# EAGLE design power_converter (EAGLE 9.2.1)
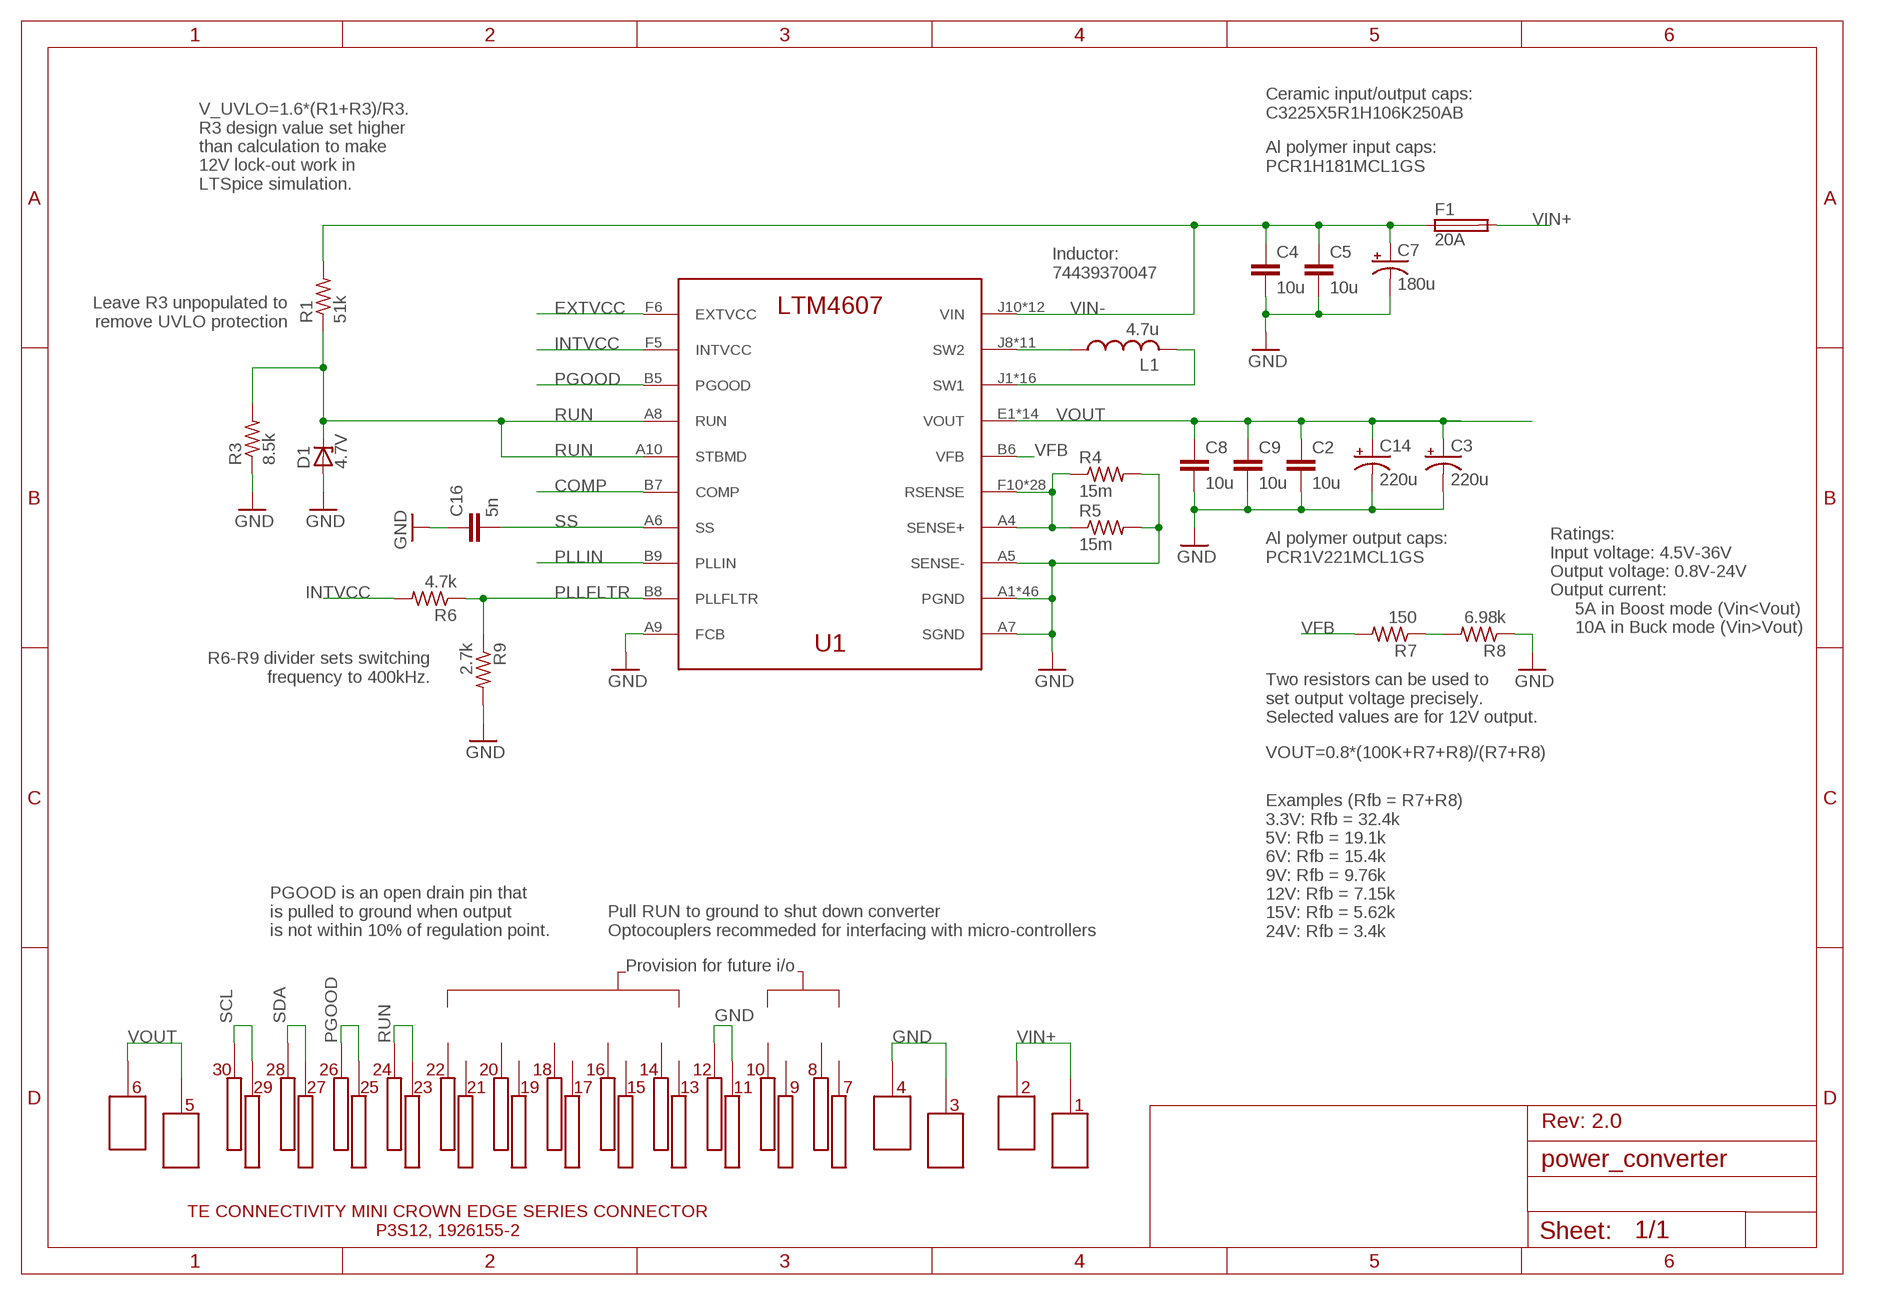
[diagram p0: schematic, sheet 1]

## Parts
C2  10u  C-EUC1210  [C1210]
C3  220u  PCR1V221MCL1GS  [PCR1V221MCL1GS]
C4  10u  C-EUC1210  [C1210]
C5  10u  C-EUC1210  [C1210]
C7  180u  PCR1H181MCL1GS  [PCR1H181MCL1GS]
C8  10u  C-EUC1210  [C1210]
C9  10u  C-EUC1210  [C1210]
C14  220u  PCR1V221MCL1GS  [PCR1V221MCL1GS]
C16  5n  C-EUC0603  [C0603]
D1  4.7V  ZENER-DIODESOD80C  [SOD80C]
F1  20A  501_FUSE  [R1206]
L1  4.7u  PA4343.472ANLT  [PA4343.472ANLT]
R1  51k  R-US_R0603  [R0603]
R3  8.5k  R-US_R0603  [R0603]
R4  15m  R-US_R1206  [R1206]
R5  15m  R-US_R1206  [R1206]
R6  4.7k  R-US_R0603  [R0603]
R7  150  R-US_R0603  [R0603]
R8  6.98k  R-US_R0603  [R0603]
R9  2.7k  R-US_R0603  [R0603]
U1  LTM4607EVPBF  [LGA-141]
U$1  1926155-2_CARD  [1926155-2_CARD]

## Nets
COMP: U1.B7(COMP)
EXTVCC: U1.F6(EXTVCC)
GND: C2.2 C3.NEG(-) C4.2 C5.2 C7.NEG(-) C8.2 C9.2 C14.NEG(-) C16.1 D1.A R3.1 R4.2 R5.2 R8.1 R9.2 U1.A1(PGND) U1.A2(PGND) U1.A3(PGND) U1.A5(SENSE-) U1.A7(SGND) U1.A9(FCB) U1.A11(PGND) U1.A12(PGND) U1.B1(PGND) U1.B2(PGND) U1.B3(PGND) U1.B4(PGND) U1.B10(PGND) U1.B11(PGND) U1.B12(PGND) U1.C1(PGND) U1.C2(PGND) U1.C3(PGND) U1.C4(PGND) U1.C5(PGND) U1.C6(PGND) U1.C7(PGND) U1.C8(PGND) U1.C9(PGND) U1.C10(PGND) U1.C11(PGND) U1.C12(PGND) U1.D1(PGND) U1.D2(PGND) U1.D3(PGND) U1.D4(PGND) U1.D5(PGND) U1.D6(PGND) U1.D7(PGND) U1.D8(PGND) U1.D9(PGND) U1.D10(PGND) U1.D11(PGND) U1.D12(PGND) U1.E3(PGND) U1.E4(PGND) U1.E5(PGND) U1.E6(PGND) U1.E7(PGND) U1.E8(PGND) U1.E9(PGND) U1.E10(PGND) U1.E11(PGND) U1.E12(PGND) U$1.P$3 U$1.P$4 U$1.P$11 U$1.P$12
INTVCC: R6.2 U1.F5(INTVCC)
N$1: R7.1 R8.2
PGOOD: U1.B5(PGOOD) U$1.P$25 U$1.P$26
PLLFLTR: R6.1 R9.1 U1.B8(PLLFLTR)
PLLIN: U1.B9(PLLIN)
RSENSE: R4.1 R5.1 U1.A4(SENSE+) U1.F10(RSENSE) U1.F11(RSENSE) U1.F12(RSENSE) U1.G5(RSENSE) U1.G6(RSENSE) U1.G7(RSENSE) U1.G8(RSENSE) U1.G9(RSENSE) U1.G10(RSENSE) U1.G11(RSENSE) U1.G12(RSENSE) U1.H5(RSENSE) U1.H6(RSENSE) U1.H7(RSENSE) U1.H8(RSENSE) U1.H9(RSENSE) U1.H10(RSENSE) U1.H11(RSENSE) U1.H12(RSENSE) U1.J5(RSENSE) U1.J6(RSENSE) U1.J7(RSENSE) U1.K5(RSENSE) U1.K6(RSENSE) U1.L5(RSENSE) U1.L6(RSENSE) U1.M5(RSENSE) U1.M6(RSENSE)
RUN: D1.C R1.1 R3.2 U1.A8(RUN) U1.A10(STBMD) U$1.P$23 U$1.P$24
SCL: U$1.P$29 U$1.P$30
SDA: U$1.P$27 U$1.P$28
SS: C16.2 U1.A6(SS)
SW1: L1.P$2 U1.J1(SW1) U1.J2(SW1) U1.J3(SW1) U1.J4(SW1) U1.K1(SW1) U1.K2(SW1) U1.K3(SW1) U1.K4(SW1) U1.L1(SW1) U1.L2(SW1) U1.L3(SW1) U1.L4(SW1) U1.M1(SW1) U1.M2(SW1) U1.M3(SW1) U1.M4(SW1)
SW2: L1.P$1 U1.J8(SW2) U1.J9(SW2) U1.K7(SW2) U1.K8(SW2) U1.K9(SW2) U1.L7(SW2) U1.L8(SW2) U1.L9(SW2) U1.M7(SW2) U1.M8(SW2) U1.M9(SW2)
VFB: R7.2 U1.B6(VFB)
VIN+: F1.2 U$1.P$1 U$1.P$2
VIN-: C4.1 C5.1 C7.POS(+) F1.1 R1.2 U1.J10(VIN) U1.J11(VIN) U1.J12(VIN) U1.K10(VIN) U1.K11(VIN) U1.K12(VIN) U1.L10(VIN) U1.L11(VIN) U1.L12(VIN) U1.M10(VIN) U1.M11(VIN) U1.M12(VIN)
VOUT: C2.1 C3.POS(+) C8.1 C9.1 C14.POS(+) U1.E1(VOUT) U1.E2(VOUT) U1.F1(VOUT) U1.F2(VOUT) U1.F3(VOUT) U1.F4(VOUT) U1.G1(VOUT) U1.G2(VOUT) U1.G3(VOUT) U1.G4(VOUT) U1.H1(VOUT) U1.H2(VOUT) U1.H3(VOUT) U1.H4(VOUT) U$1.P$5 U$1.P$6
Unconnected: U$1.P$7 U$1.P$8 U$1.P$9 U$1.P$10 U$1.P$13 U$1.P$14 U$1.P$15 U$1.P$16 U$1.P$17 U$1.P$18 U$1.P$19 U$1.P$20 U$1.P$21 U$1.P$22

## Notes on the sheet
- Ceramic input/output caps:
  C3225X5R1H106K250AB
- Al polymer input caps:
  PCR1H181MCL1GS
- V_UVLO=1.6*(R1+R3)/R3.
  R3 design value set higher 
  than calculation to make
  12V lock-out work in
  LTSpice simulation.
- Inductor:
  74439370047
- Leave R3 unpopulated to
  remove UVLO protection
- Ratings:
  Input voltage: 4.5V-36V
  Output voltage: 0.8V-24V
  Output current:
       5A in Boost mode (Vin<Vout)
       10A in Buck mode (Vin>Vout)
- Al polymer output caps:
  PCR1V221MCL1GS
- R6-R9 divider sets switching
  frequency to 400kHz.
- Two resistors can be used to
  set output voltage precisely.
  Selected values are for 12V output.
- VOUT=0.8*(100K+R7+R8)/(R7+R8)
- Examples (Rfb = R7+R8)
  3.3V: Rfb = 32.4k
  5V: Rfb = 19.1k
  6V: Rfb = 15.4k
  9V: Rfb = 9.76k
  12V: Rfb = 7.15k
  15V: Rfb = 5.62k
  24V: Rfb = 3.4k
- PGOOD is an open drain pin that
  is pulled to ground when output
  is not within 10% of regulation point.
- Pull RUN to ground to shut down converter
  Optocouplers recommeded for interfacing with micro-controllers
- Provision for future i/o
- Rev: 2.0

## Library data of the parts
C2 C4 C5 C8 C9 C16 = rcl:C-EU: CAPACITOR, European symbol; SPICEPREFIX: C
C3 C14 = LTM4607:PCR1V221MCL1GS
C7 = LTM4607:PCR1H181MCL1GS
D1 = diode:ZENER-DIODE: Z-Diode
F1 = LTM4607:501_FUSE
L1 = LTM4607:PA4343.472ANLT
R1 R3-R9 = rcl:R-US_: RESISTOR, American symbol; SPICEPREFIX: R
U1 = LTM4607:LTM4607EVPBF; MANUFACTURER_PART_NUMBER: LTM4607EV#PBF; VENDOR: Linear Technology
U$1 = LTM4607:1926155-2_CARD

## Board
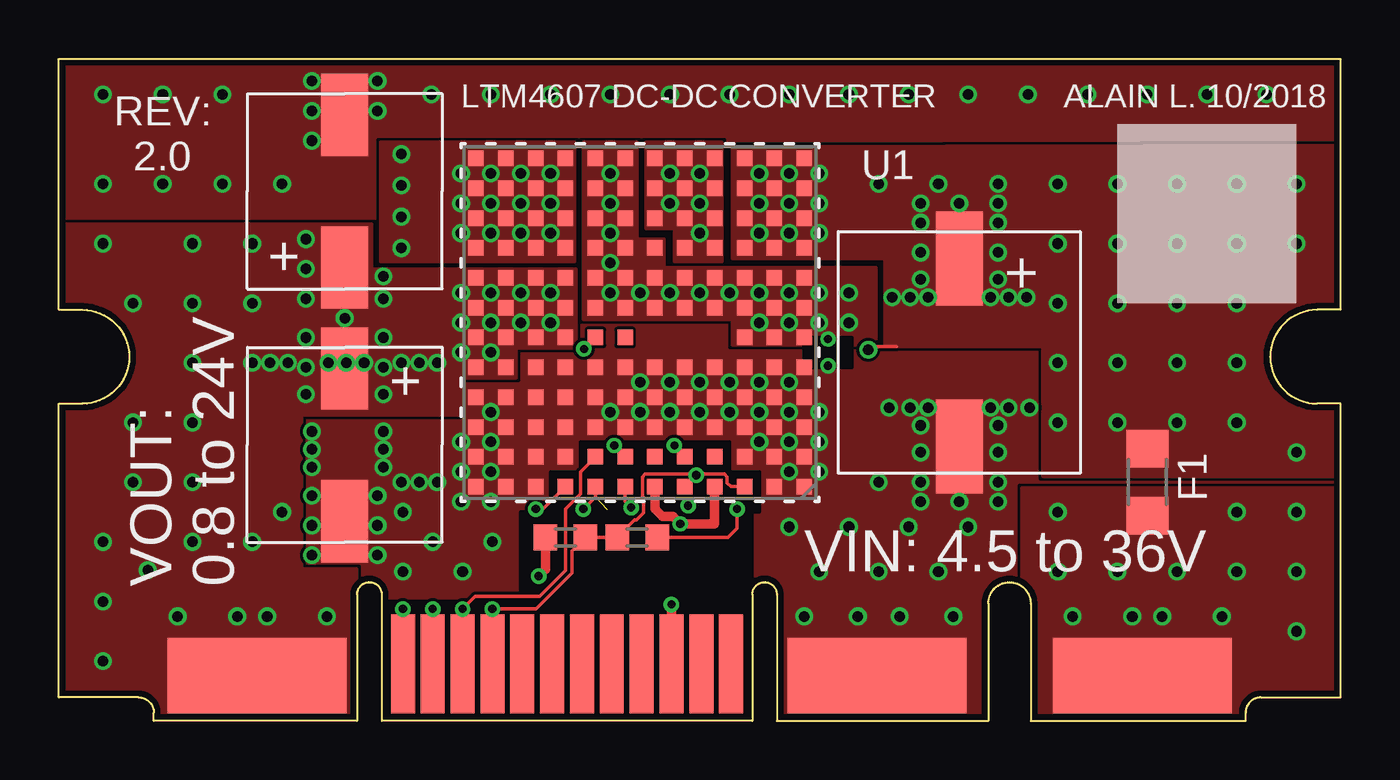
[diagram p1: board, top side]
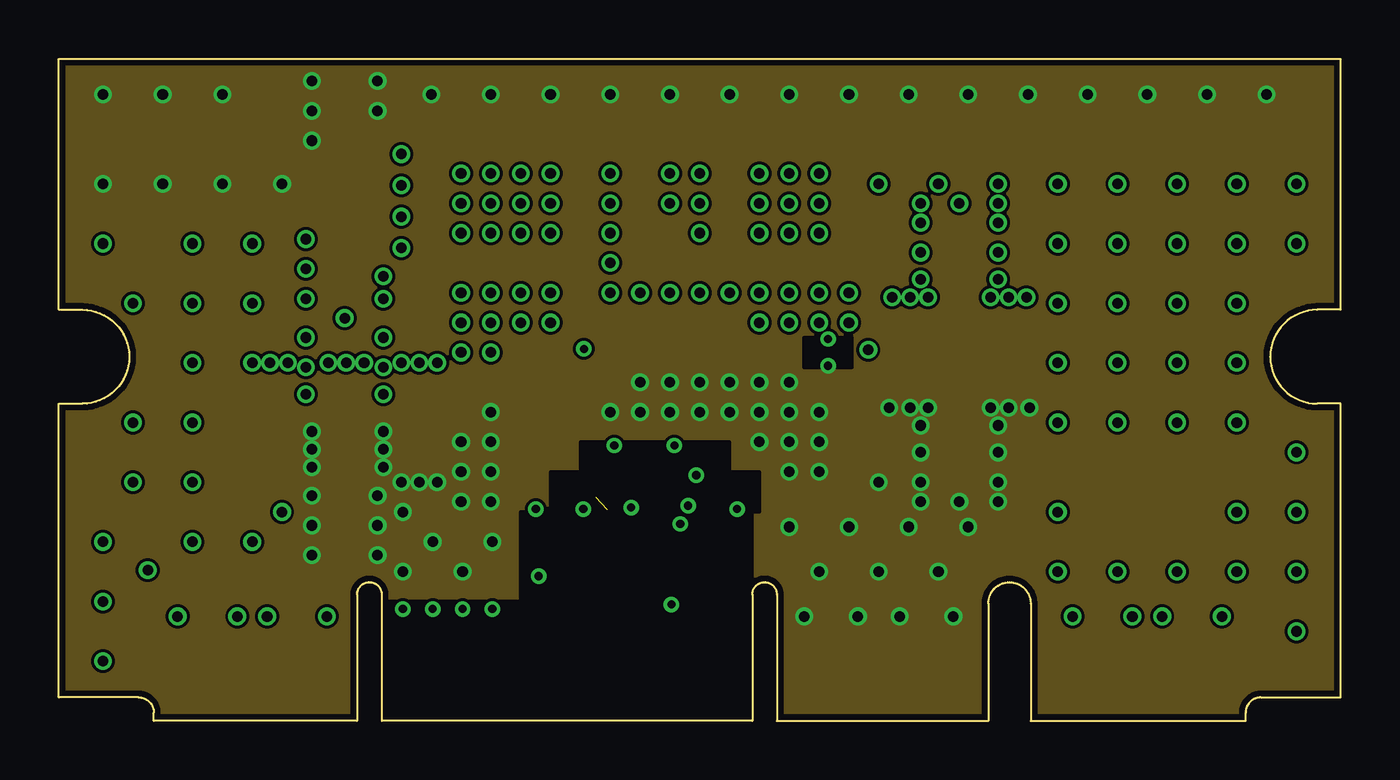
[diagram p2: board, inner layer Route2]
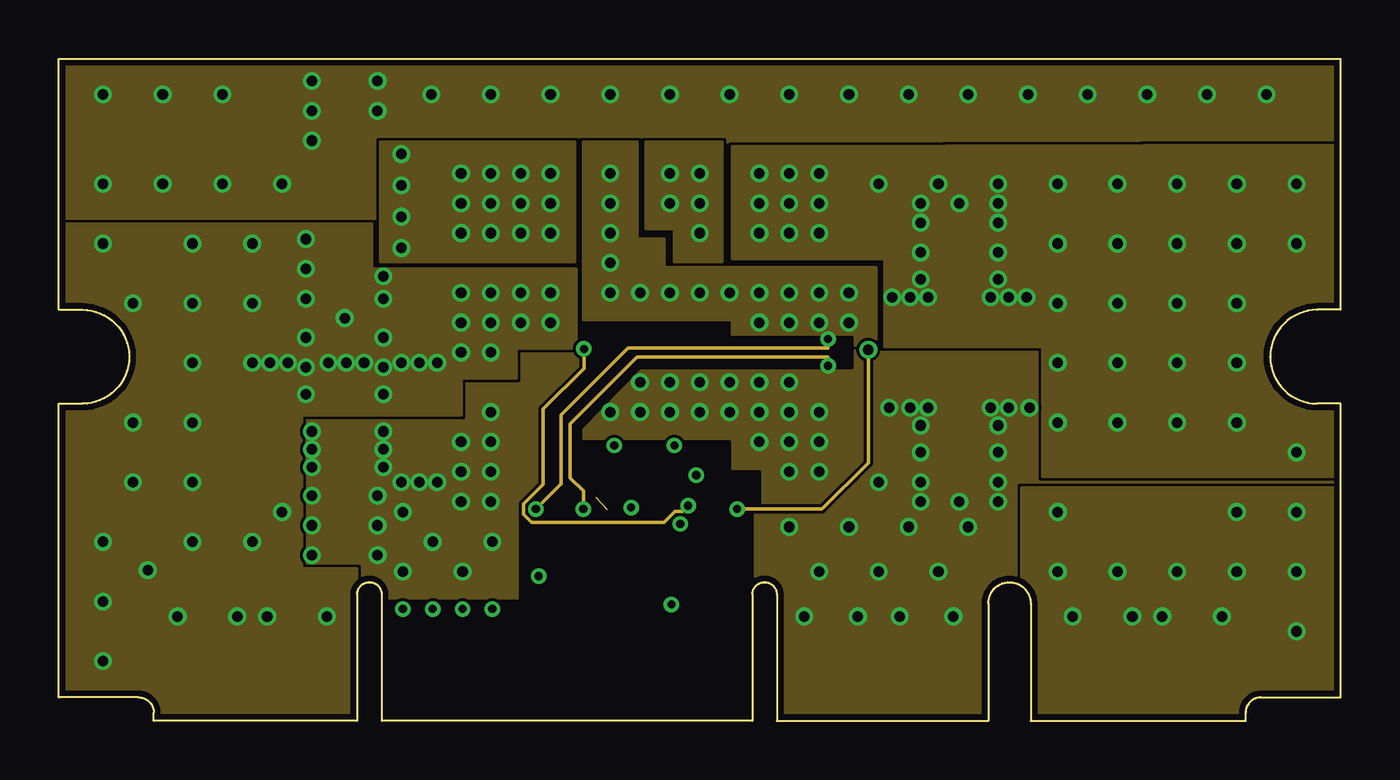
[diagram p3: board, inner layer Route15]
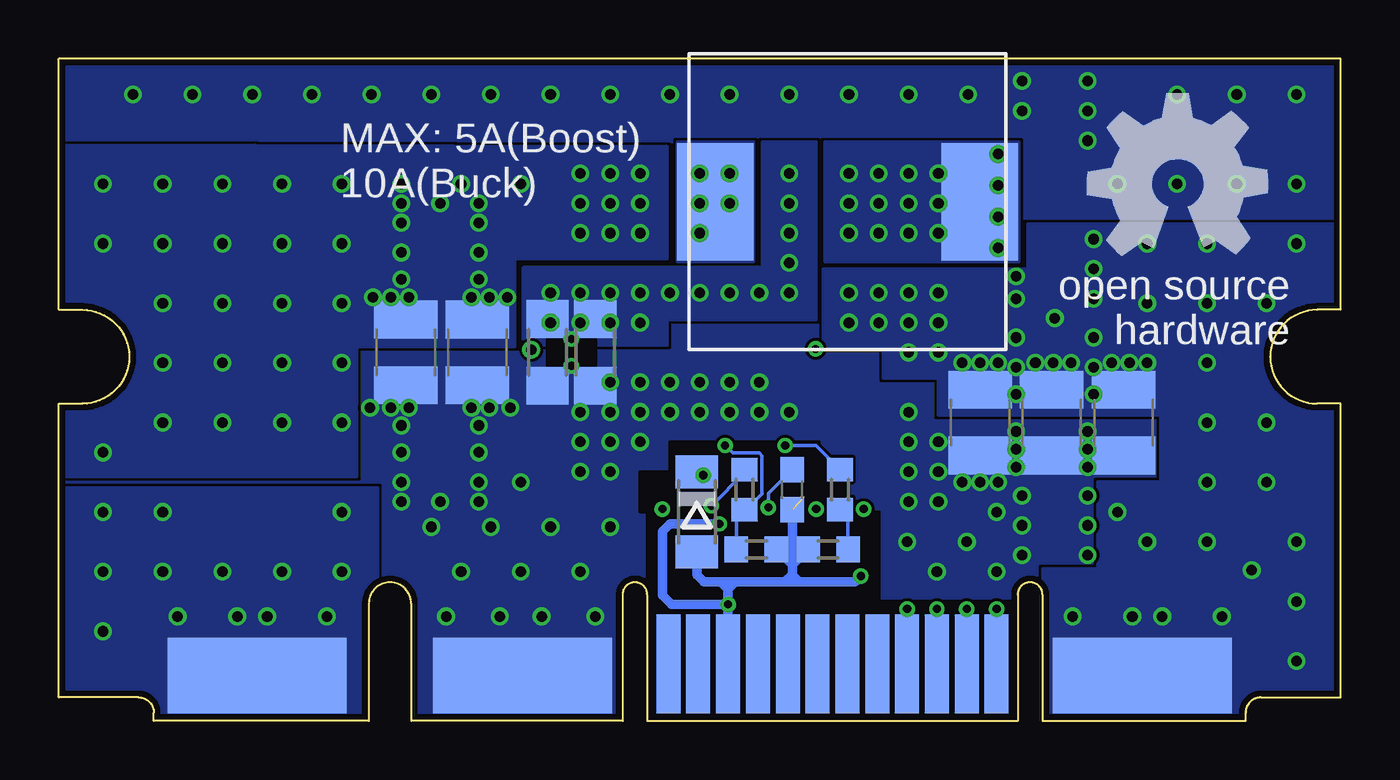
[diagram p4: board, bottom side, seen from below]

Size 54.57 x 28.19 mm. Coordinates in mm from the lower left corner, seen from the top.
Copper layers (1*2*15*16): Top 0.035mm / dielectric 0.1702mm / Route2 0.0175mm / dielectric 47mil / Route15 0.0175mm / dielectric 0.1702mm / Bottom 0.035mm
Design rules "JLCPCB4Layer *": minimum track width 3.5mil, minimum drill 0.2mm, track to track 5mil, track to pad 5mil, pad to pad 5mil, via to via 5mil, smd to smd 0mil, copper to edge 10mil, drill to drill 10mil, minimum pad ring 6mil, minimum via ring 6mil, stop-mask expansion 2mil, vias tented up to drill 100mil, thermal gap 10mil

### Footprints (pad centres in the part's own frame; a part is rotated, then mirrored left to right if it is on the bottom)
C1210 = smd 1.6 x 2.7: 1 -1.4,0; 2 1.4,0
PCR1V221MCL1GS = smd 2 x 3.5: NEG 0,-3.25; POS 0,3.25
PCR1H181MCL1GS = smd 2 x 4: NEG 0,-4; POS 0,4
C0603 = smd 1.1 x 1: 1 -0.85,0; 2 0.85,0
SOD80C = smd 1.4 x 1.8: A 1.7,0; C -1.7,0
R1206 = smd 1.6 x 1.803: 1 -1.422,0; 2 1.422,0
PA4343.472ANLT = smd 3.25 x 5: P$1 -5.625,0; P$2 5.625,0
R0603 = smd 1 x 1.1: 1 -0.85,0; 2 0.85,0
LGA-141 = smd 0.66 x 0.66: A1 6.985,6.985; A2 5.715,6.985; A3 4.445,6.985; A4 3.175,6.985; A5 1.905,6.985; A6 0.635,6.985; A7 -0.635,6.985; A8 -1.905,6.985; A9 -3.175,6.985; A10 -4.445,6.985; A11 -5.715,6.985; A12 -6.985,6.985; B1 6.985,5.715; B2 5.715,5.715; B3 4.445,5.715; B4 3.175,5.715; B5 1.905,5.715; B6 0.635,5.715; B7 -0.635,5.715; B8 -1.905,5.715; B9 -3.175,5.715; B10 -4.445,5.715; B11 -5.715,5.715; B12 -6.985,5.715; C1 6.985,4.445; C2 5.715,4.445; C3 4.445,4.445; C4 3.175,4.445; C5 1.905,4.445; C6 0.635,4.445; C7 -0.635,4.445; C8 -1.905,4.445; C9 -3.175,4.445; C10 -4.445,4.445; C11 -5.715,4.445; C12 -6.985,4.445; D1 6.985,3.175; D2 5.715,3.175; D3 4.445,3.175; D4 3.175,3.175; D5 1.905,3.175; D6 0.635,3.175; D7 -0.635,3.175; D8 -1.905,3.175; D9 -3.175,3.175; D10 -4.445,3.175; D11 -5.715,3.175; D12 -6.985,3.175; E1 6.985,1.905; E2 5.715,1.905; E3 4.445,1.905; E4 3.175,1.905; E5 1.905,1.905; E6 0.635,1.905; E7 -0.635,1.905; E8 -1.905,1.905; E9 -3.175,1.905; E10 -4.445,1.905; E11 -5.715,1.905; E12 -6.985,1.905; F1 6.985,0.635; F2 5.715,0.635; F3 4.445,0.635; F4 3.175,0.635; F5 1.905,0.635; F6 0.635,0.635; F10 -4.445,0.635; F11 -5.715,0.635; F12 -6.985,0.635; G1 6.985,-0.635; G2 5.715,-0.635; G3 4.445,-0.635; G4 3.175,-0.635; G5 1.905,-0.635; G6 0.635,-0.635; G7 -0.635,-0.635; G8 -1.905,-0.635; G9 -3.175,-0.635; G10 -4.445,-0.635; G11 -5.715,-0.635; G12 -6.985,-0.635; H1 6.985,-1.905; H2 5.715,-1.905; H3 4.445,-1.905; H4 3.175,-1.905; H5 1.905,-1.905; H6 0.635,-1.905; H7 -0.635,-1.905; H8 -1.905,-1.905; H9 -3.175,-1.905; H10 -4.445,-1.905; H11 -5.715,-1.905; H12 -6.985,-1.905; J1 6.985,-3.175; J2 5.715,-3.175; J3 4.445,-3.175; J4 3.175,-3.175; J5 1.905,-3.175; J6 0.635,-3.175; J7 -0.635,-3.175; J8 -1.905,-3.175; J9 -3.175,-3.175; J10 -4.445,-3.175; J11 -5.715,-3.175; J12 -6.985,-3.175; K1 6.985,-4.445; K2 5.715,-4.445; K3 4.445,-4.445; K4 3.175,-4.445; K5 1.905,-4.445; K6 0.635,-4.445; K7 -0.635,-4.445; K8 -1.905,-4.445; K9 -3.175,-4.445; K10 -4.445,-4.445; K11 -5.715,-4.445; K12 -6.985,-4.445; L1 6.985,-5.715; L2 5.715,-5.715; L3 4.445,-5.715; L4 3.175,-5.715; L5 1.905,-5.715; L6 0.635,-5.715; L7 -0.635,-5.715; L8 -1.905,-5.715; L9 -3.175,-5.715; L10 -4.445,-5.715; L11 -5.715,-5.715; L12 -6.985,-5.715; M1 6.985,-6.985; M2 5.715,-6.985; M3 4.445,-6.985; M4 3.175,-6.985; M5 1.905,-6.985; M6 0.635,-6.985; M7 -0.635,-6.985; M8 -1.905,-6.985; M9 -3.175,-6.985; M10 -4.445,-6.985; M11 -5.715,-6.985; M12 -6.985,-6.985
1926155-2_CARD = smd 7.62 x 3.2: P$1 18.835,1.929; P$3 7.535,1.929; P$5 -18.835,1.929 | smd 7.62 x 3.2 bottom: P$2 18.835,1.929; P$4 7.535,1.929; P$6 -18.835,1.929 | smd 1.02 x 4.2: P$7 1.335,2.429; P$9 0.065,2.429; P$11 -1.205,2.429; P$13 -2.475,2.429; P$15 -3.745,2.429; P$17 -5.015,2.429; P$19 -6.285,2.429; P$21 -7.555,2.429; P$23 -8.825,2.429; P$25 -10.095,2.429; P$27 -11.365,2.429; P$29 -12.635,2.429 | smd 1.02 x 4.2 bottom: P$8 1.335,2.429; P$10 0.065,2.429; P$12 -1.205,2.429; P$14 -2.475,2.429; P$16 -3.745,2.429; P$18 -5.015,2.429; P$20 -6.285,2.429; P$22 -7.555,2.429; P$24 -8.825,2.429; P$26 -10.095,2.429; P$28 -11.365,2.429; P$30 -12.635,2.429

### Placement (x,y rotation side)
C2  9.25,12.7 270 bottom
C3  12.17,11.75 0 top
C4  36.75,15.68 270 bottom
C5  39.79,15.68 270 bottom
C7  38.33,15.68 0 top
C8  12.3,12.7 270 bottom
C9  15.35,12.7 270 bottom
C14  12.17,22.54 180 top
C16  23.35,9.84 90 bottom
D1  27.41,8.89 270 bottom
F1  46.34,10.16 270 top
L1  21,22.1 0 bottom
R1  24.62,7.81 0 top
R3  21.57,7.81 0 top
R4  31.73,15.68 270 bottom
R5  33.76,15.68 270 bottom
R6  25.38,9.84 90 bottom
R7  21.32,9.84 90 bottom
R8  21.82,7.3 0 bottom
R9  24.87,7.3 0 bottom
U1  24.75,16.95 180 top
U$1  27.29,0 0 top
U$2  [OSHW_8MM]  6.97,22.86 0 bottom
U$5  [A4L-LOC]  -102.25,-77.47 0 top  (outside the outline)

### Tracks (layer width: path | path; a pad name or v marks a point on that pad's centre or on a via)
GND  (via drill 0.35, 0.45)  (1 unrouted)
  Top 0.152: v22.33,9.02 22.84,9.52 U1.A5
  Top 0.406: v26.08,4.95 U$1.P$11 | U1.A7 25.38,9.02 25.7,8.7 26.14,8.7 v26.46,8.38 27.92,8.38 U1.A9 | v20.43,6.16 20.72,6.45 R3.1
  Route15 0.152: v32.75,15.11 32.75,15.49 24.62,15.49 21.76,12.64 21.76,10.35 22.33,9.78 v22.33,9.02
  Bottom 0.406: 26.08,5.59 26.4,5.91 | 26.4,5.91 27.09,5.91 27.41,6.22 D1.A | U$1.P$11 v26.08,4.95 | 26.08,5.59 25.76,5.91 | 25.76,5.91 23.92,5.91 | 23.92,5.91 23.67,5.91 23.35,6.22 | 23.35,6.63 R9.2 | 23.35,6.22 23.35,6.63 | 23.35,6.63 R8.1 | 25.76,5.91 26.4,5.91 | 26.08,5.59 v26.08,4.95 | v26.08,4.95 28.49,4.95 28.87,5.33 28.87,8.06 28.56,8.38 v26.46,8.38 | 23.35,6.22 23.03,5.91 | v20.43,6.16 20.68,5.91 23.03,5.91 | 23.03,5.91 23.92,5.91 | 23.35,6.22 C16.1 | R5.2 33.6,14.26 v32.75,15.11 31.9,14.26 R4.2
  other vias: 18.4,10.6 18.4,11.87 18.4,13.14 18.4,9.33 17.12,9.33 17.12,10.6 17.12,11.87 24.75,14.41 24.75,13.14 23.48,13.14 26.02,13.14 26.02,14.41 27.29,14.41 27.29,13.14 28.56,13.14 28.56,14.41 29.83,14.41 29.83,13.14 29.83,11.87 31.1,13.14 31.1,14.41 32.37,11.87 32.37,13.14 31.1,11.87 31.1,10.6 32.37,10.6 31.1,8.25 32.37,6.35 33.64,8.25 36.17,8.25 38.72,8.25 34.91,6.35 37.45,6.35 34.02,4.44 35.79,4.44 38.08,4.44 31.73,4.44 34.91,10.16 36.68,12.57 39.98,12.57 36.68,9.33 39.98,9.33 39.98,11.43 36.68,11.43 36.68,10.16 39.98,10.16 38.33,9.33 36.24,13.33 37,13.33 35.35,13.33 39.67,13.33 40.43,13.33 41.32,13.33 10.78,11.56 10.78,10.79 15.35,10.16 14.59,10.16 16.11,10.16 13.82,11.56 13.82,12.32 13.82,10.79 10.78,12.32 10.78,7.05 10.78,8.32 10.78,9.59 13.57,7.05 13.57,8.32 13.57,9.59 10.78,24.7 10.78,25.97 10.78,27.24 13.57,25.97 13.57,27.24 17.19,6.35 14.65,6.35 14.65,8.89 18.46,7.62 15.92,7.62 1.89,26.67 1.89,22.86 4.43,22.86 4.43,26.67 6.97,26.67 6.97,22.86 9.51,22.86 15.86,26.67 18.4,26.67 20.94,26.67 23.48,26.67 26.02,26.67 28.56,26.67 31.1,26.67 33.64,26.67 36.17,26.67 38.72,26.67 41.25,26.67 43.8,26.67 46.34,26.67 48.88,26.67 51.42,26.67
  pour Top (rank 6, no thermals): -0.65,0 -0.65,29.21 55.23,29.21 55.23,0
  pour Route2 (rank 6, no thermals): -0.65,29.21 55.23,29.21 55.23,0 -0.65,0
  pour Bottom (rank 6, no thermals): -0.65,29.21 55.23,29.21 55.23,0 -0.65,0
  pour Route15 (rank 6, no thermals): -0.65,29.21 55.23,29.21 55.23,0 -0.65,0
  cutout Top: 13.76,0 13.76,5.08 19.67,5.08 19.67,8.89 20.94,8.89 20.94,10.6 22.21,10.6 22.21,11.87 22.27,11.87 28.56,11.87 28.56,10.6 28.68,10.6 29.83,10.6 29.83,10.16 29.83,8.89 29.51,8.89 29.51,0
  cutout Route15 (no thermals): 33.76,16.32 24.11,16.32 20.94,13.14 20.94,10.6 20.94,9.33 23.35,9.33 23.35,10.6 22.21,10.6 22.21,12.45 24.75,15.05 33.76,15.05
  cutout Top (no thermals): 33.76,16.32 31.73,16.32 31.73,15.05 33.76,15.05
  cutout Route2 (no thermals): 33.76,16.32 31.73,16.32 31.73,15.05 33.76,15.05
  cutout Route2 (no thermals): 23.35,10.6 20.94,10.6 20.94,9.33 23.35,9.33
  cutout Top (no thermals): 23.35,10.6 20.94,10.6 20.94,9.33 23.35,9.33
  cutout Route15: 13.76,0 13.76,5.08 19.67,5.08 19.67,8.89 20.94,8.89 20.94,10.6 22.21,10.6 22.21,11.87 22.27,11.87 28.56,11.87 28.56,10.6 28.68,10.6 29.83,10.6 29.83,10.16 29.83,8.89 29.51,8.89 29.51,0
  cutout Route2: 13.76,0 13.76,5.08 19.67,5.08 19.67,8.89 20.94,8.89 20.94,10.6 22.21,10.6 22.21,11.87 22.27,11.87 28.56,11.87 28.56,10.6 28.68,10.6 29.83,10.6 29.83,10.16 29.83,8.89 29.51,8.89 29.51,0
  cutout Bottom: 13.76,0 13.76,5.08 19.67,5.08 19.67,8.89 20.94,8.89 20.94,10.6 22.21,10.6 22.21,11.87 22.27,11.87 28.56,11.87 28.56,10.6 28.68,10.6 29.83,10.6 29.83,10.16 29.83,8.89 29.51,8.89 29.51,0
  cutout Bottom (no thermals): 33.76,16.32 31.73,16.32 31.73,15.05 33.76,15.05
INTVCC  (via drill 0.35)
  Top 0.152: U1.F5 v22.36,15.83
  Route15 0.152: v22.36,15.83 22.36,15.01 20.62,13.27 20.62,10.07 19.78,9.24 19.78,8.8 20.13,8.45 25.77,8.45 26.24,8.91 26.55,8.91 v26.79,9.16
  Bottom 0.152: v26.79,9.16 25.38,10.57 R6.2
N$1
  Bottom 0.152: R8.2 20.97,8.65 R7.1
PGOOD  (via drill 0.35)
  Top 0.152: U1.B5 22.21,10.6 22.21,9.65 21.57,9.02 21.57,6.41 20.46,5.3 17.73,5.3 v17.19,4.76 U$1.P$25
  Bottom 0.152: v17.19,4.76 U$1.P$25
PLLFLTR  (via drill 0.35)
  Top 0.152: U1.B8 26.21,11.68 v26.21,11.72
  Bottom 0.152: R9.1 25.72,8.65 R6.1 25.3,8.99 24.64,9.65 24.64,9.79 24.63,9.81 24.63,11.28 24.75,11.4 25.88,11.4 v26.21,11.72
RSENSE  (via drill 0.35, 0.45)
  Top 0.152: v20.31,9.02 20.62,9.02 U1.A4
  Route15 0.152: v32.75,16.26 32.75,15.87 24.24,15.87 21.38,13.02 21.38,10.08 v20.31,9.02
  Bottom 0.406: R5.1 33.6,17.11 v32.75,16.26 31.9,17.11 R4.1
  other vias: 23.48,23.3 23.48,22.03 23.48,20.76 23.48,19.49 23.48,18.22 24.75,18.22 26.02,18.22 27.29,18.22 28.56,18.22 29.83,18.22 29.83,16.95 31.1,16.95 31.1,18.22 32.37,18.22 32.37,16.95 33.64,18.22 33.64,16.95
  pour Top (no thermals): 22.33,24.64 24.62,24.64 24.62,20.51 25.76,20.51 25.76,19.3 34.78,19.3 34.78,16 32.3,16 28.68,16 28.68,17.02 28.68,17.08 22.33,17.08
  pour Route15 (no thermals): 22.33,24.64 24.62,24.64 24.62,20.51 25.76,20.51 25.76,19.3 34.78,19.3 34.78,16 33.57,16 28.68,16 28.68,17.02 28.68,17.08 22.33,17.08
  pour Bottom (no thermals): 22.33,24.64 24.62,24.64 24.62,19.3 34.78,19.3 34.78,16 32.3,16 28.68,16 28.68,17.02 28.68,17.08 22.33,17.08
RUN  (via drill 0.35)
  Top 0.152: 26.97,10.5 24.97,10.5 24.85,10.38 24.85,9.55 24.9,9.51 24.9,8.86 24.58,8.55 24.51,8.55 R1.1 R3.2 21.85,7.24 21.85,6.3 20.31,4.76 v18.46,4.76 U$1.P$24 | 26.97,10.5 27.29,10.5 | 27.29,10.5 28.33,10.5 28.45,10.38 28.45,10.13 28.62,9.97 U1.A10 | 27.29,10.5 27.24,10.45 v27.14,10.45 | U1.A8 26.97,10.29 26.97,10.5
  Bottom 0.152: v27.14,10.45 27.28,10.45 D1.C | v18.46,4.76 U$1.P$24
SCL  (via drill 0.35)
  Top 0.152: U$1.P$29 v14.65,4.76
  Bottom 0.152: v14.65,4.76 U$1.P$29
SDA  (via drill 0.35)
  Top 0.152: U$1.P$28 v15.92,4.76
  Bottom 0.152: v15.92,4.76 U$1.P$28
SS  (via drill 0.35)
  Top 0.152: v24.36,9.08 24.11,9.33 U1.A6
  Bottom 0.152: C16.2 24.36,9.68 v24.36,9.08
SW1  (via drill 0.45)
  other vias: 20.94,20.76 20.94,22.03 20.94,23.3 19.67,23.3 19.67,22.03 19.67,20.76 18.4,20.76 18.4,23.3 18.4,22.03 17.12,22.03 17.12,23.3 17.12,20.76 14.59,24.13 14.59,22.8 14.59,21.46 14.59,20.13
  pour Top (no thermals): 13.7,19.56 13.7,24.64 21.95,24.64 21.95,19.56
  pour Route15 (no thermals): 13.7,19.56 13.7,24.64 21.95,24.64 21.95,19.56
  pour Bottom (no thermals): 13.7,19.56 13.7,24.64 21.95,24.64 21.95,19.56
SW2  (via drill 0.45)
  other vias: 26.02,23.3 26.02,22.03 27.29,22.03 27.29,23.3 27.29,20.76
  pour Bottom (no thermals): 28.24,24.64 25,24.64 25,24.57
  pour Route15 (no thermals): 28.24,24.64 25,24.64 25,24.57
  pour Top (rank 2, no thermals): 28.24,24.64 25,24.64 25,24.57 25,20.96 26.21,20.96 26.21,19.56 28.24,19.56
  pour Route15 (rank 2, no thermals): 28.24,24.64 25,24.64 25,24.57 25,20.96 26.21,20.96 26.21,19.56 28.24,19.56
  pour Bottom (rank 2, no thermals): 28.24,24.64 25,24.64 25,24.57 25,19.56 28.24,19.56
VFB  (via drill 0.35)
  Top 0.152: U1.B6 v23.64,11.72
  Bottom 0.152: v23.64,11.72 22.35,11.72 R7.2
VIN+  (via drill 0.45)
  other vias: 42.53,8.89 42.53,6.35 45.06,6.35 47.61,6.35 50.14,6.35 52.69,6.35 52.69,8.89 50.14,8.89 49.51,4.44 46.97,4.44 45.7,4.44 43.16,4.44 52.69,3.81
  pour Top (no thermals): 41.25,9.91 54.59,9.91 54.59,-0.06 41,-0.06 41,9.91
  pour Route15 (no thermals): 41.25,9.91 54.59,9.91 54.59,-0.06 41,-0.06 41,9.91
  pour Bottom (no thermals): 41.25,9.91 54.59,9.91 54.59,-0.06 41,-0.06 41,9.91
VIN-  (via drill 0.35, 0.45)
  Top 0.152: R1.2 28.49,7.81 28.87,8.19 v28.87,9.02 | v34.46,15.8 34.6,15.94 35.67,15.94
  Route15 0.152: v28.87,9.02 32.49,9.02 34.46,10.98 v34.46,15.8
  other vias: 29.83,23.3 31.1,23.3 31.1,22.03 29.83,22.03 29.83,20.76 31.1,20.76 32.37,20.76 32.37,22.03 32.37,23.3 39.98,18.8 36.68,18.8 39.98,22.03 36.68,22.03 36.68,19.94 39.98,19.94 39.98,21.21 36.68,21.21 38.33,22.03 36.24,18.03 35.48,18.03 37,18.03 39.67,18.03 40.43,18.03 41.19,18.03 34.91,22.86 37.45,22.86 39.98,22.86 42.53,22.86 45.06,22.86 47.61,22.86 50.14,22.86 52.69,22.86 52.69,20.32 50.14,20.32 47.61,20.32 45.06,20.32 42.53,20.32 42.53,17.78 45.06,17.78 47.61,17.78 50.14,17.78 50.14,15.24 47.61,15.24 45.06,15.24 42.53,15.24 42.53,12.7 45.06,12.7 47.61,12.7 50.14,12.7 52.69,11.43
  pour Top (rank 2, no thermals): 28.75,19.68 28.68,19.68 28.68,24.45 29.32,24.45 54.59,24.51 54.59,11.56 54.59,10.41 41.89,10.41 41.89,15.94 35.16,15.94 35.16,19.68
  pour Route15 (rank 2, no thermals): 28.75,19.68 28.68,19.68 28.68,24.45 29.32,24.45 54.59,24.51 54.59,11.56 54.59,10.41 41.89,10.41 41.89,15.94 35.16,15.94 35.16,19.68
  pour Bottom (rank 2, no thermals): 28.75,19.68 28.68,19.68 28.68,24.45 29.32,24.45 54.59,24.51 54.59,11.56 54.59,10.41 41.89,10.41 41.89,15.94 35.16,15.94 35.16,19.68
VOUT  (via drill 0.45)
  other vias: 18.4,16.95 18.4,18.22 19.67,18.22 20.94,18.22 20.94,16.95 19.67,16.95 17.12,16.95 17.12,18.22 18.4,15.68 17.12,15.68 13.82,13.91 10.52,13.91 10.52,15.05 13.82,15.05 13.82,16.32 10.52,16.32 12.17,17.14 9,15.24 8.24,15.24 9.76,15.24 14.59,15.24 15.35,15.24 16.11,15.24 12.24,15.24 11.47,15.24 13,15.24 10.52,17.97 10.52,19.24 10.52,20.51 13.82,17.97 13.82,18.92 1.89,20.32 3.16,17.78 5.7,20.32 8.24,17.78 5.7,15.24 5.7,17.78 3.16,12.7 5.7,10.16 5.7,12.7 8.24,7.62 5.7,7.62 5.06,4.44 7.6,4.44 8.87,4.44 1.89,5.08 1.89,7.62 3.16,10.16 1.89,2.54 9.51,8.89 8.24,20.32 11.41,4.44 3.79,6.41
  pour Top (no thermals): 22.01,19.24 13.32,19.24 13.32,19.49 13.32,21.15 11.09,21.15 11.03,21.15 0.04,21.15 0.04,0 12.05,0 12.43,0 12.68,0 12.68,6.48 10.33,6.48 10.33,13.02 12.68,13.02 13.32,13.02 17.12,13.02 17.12,14.48 17.12,14.6 18.14,14.6 19.47,14.6 19.47,15.43 19.47,15.87 22.01,15.87
  pour Bottom (no thermals): 22.01,19.24 13.32,19.24 13.32,19.49 13.32,21.15 11.09,21.15 11.03,21.15 0.04,21.15 0.04,0 12.05,0 12.43,0 12.68,0 12.68,6.48 10.33,6.48 10.33,10.16 7.66,10.16 7.66,13.02 17.12,13.02 17.12,14.48 17.12,14.6 18.14,14.6 19.47,14.6 19.47,15.43 19.47,15.87 22.01,15.87
  pour Route15 (no thermals): 22.01,19.24 13.32,19.24 13.32,19.49 13.32,21.15 11.09,21.15 11.03,21.15 0.04,21.15 0.04,0 12.05,0 12.43,0 12.68,0 12.68,6.48 10.33,6.48 10.33,13.02 12.68,13.02 13.32,13.02 17.12,13.02 17.12,14.48 17.12,14.6 18.14,14.6 19.47,14.6 19.47,15.43 19.47,15.87 22.01,15.87

### Text on the board
tPlace: REV: / 2.0 | LTM4607 DC-DC CONVERTER | ALAIN L. 10/2018 | VIN: 4.5 to 36V | VOUT: / 0.8 to 24V
bPlace: MAX: 5A(Boost) / 10A(Buck)
Reference: NOTES: / 1. Solder board in the folowing order: / 1.1 Reflow solder top side using leaded solder paste with stencil / 1.2 Hand solder bottom side / 2. Solid silk-screen square to be used for noting designed output voltage / 3. Card-edge style board fits into TE Connectivity Mini Crown Edge Connector P3S12 1926155-2